# Altium schematic sheet MCU103A_AltRouting_Misc.SchDoc
size 431 x 279 mm; Date: Not shown in title block; ApprovedBy: Not shown in title block; CheckedBy: Not shown in title block; Author: Not shown in title block; CompanyName: Not shown in title block; Engineer: Not shown in title block; Organization: Not shown in title block; Address1: Not shown in title block; Address2: Not shown in title block; Address3: Not shown in title block; Address4: Not shown in title block; DocumentNumber: 3; Revision: Use project parameter SCH_Rev; SheetNumber: 3; SheetTotal: 8; PageSetup: Record=PageOptions|CenterHorizontal=True|CenterVertical=True|PrintScale=1.00|XCorrection=1.00|YCorrection=1.00|PrintKind=0|BorderSize=5000000|LeftOffset=0|BottomOffset=0|Orientation=2|PaperLength=1000|PaperWidth=1000|Scale=100|PaperSource=15|PrintQuality=600|MediaType=1|DitherType=10|PaperKind=Letter|PrintScaleMode=1; CurrentTime: Not shown in title block; CurrentDate: Not shown in title block; Time: Not shown in title block; DocumentFullPathAndName: Not shown in title block; DocumentName: Not shown in title block; ModifiedDate: Not shown in title block; ImagePath: Not shown in title block
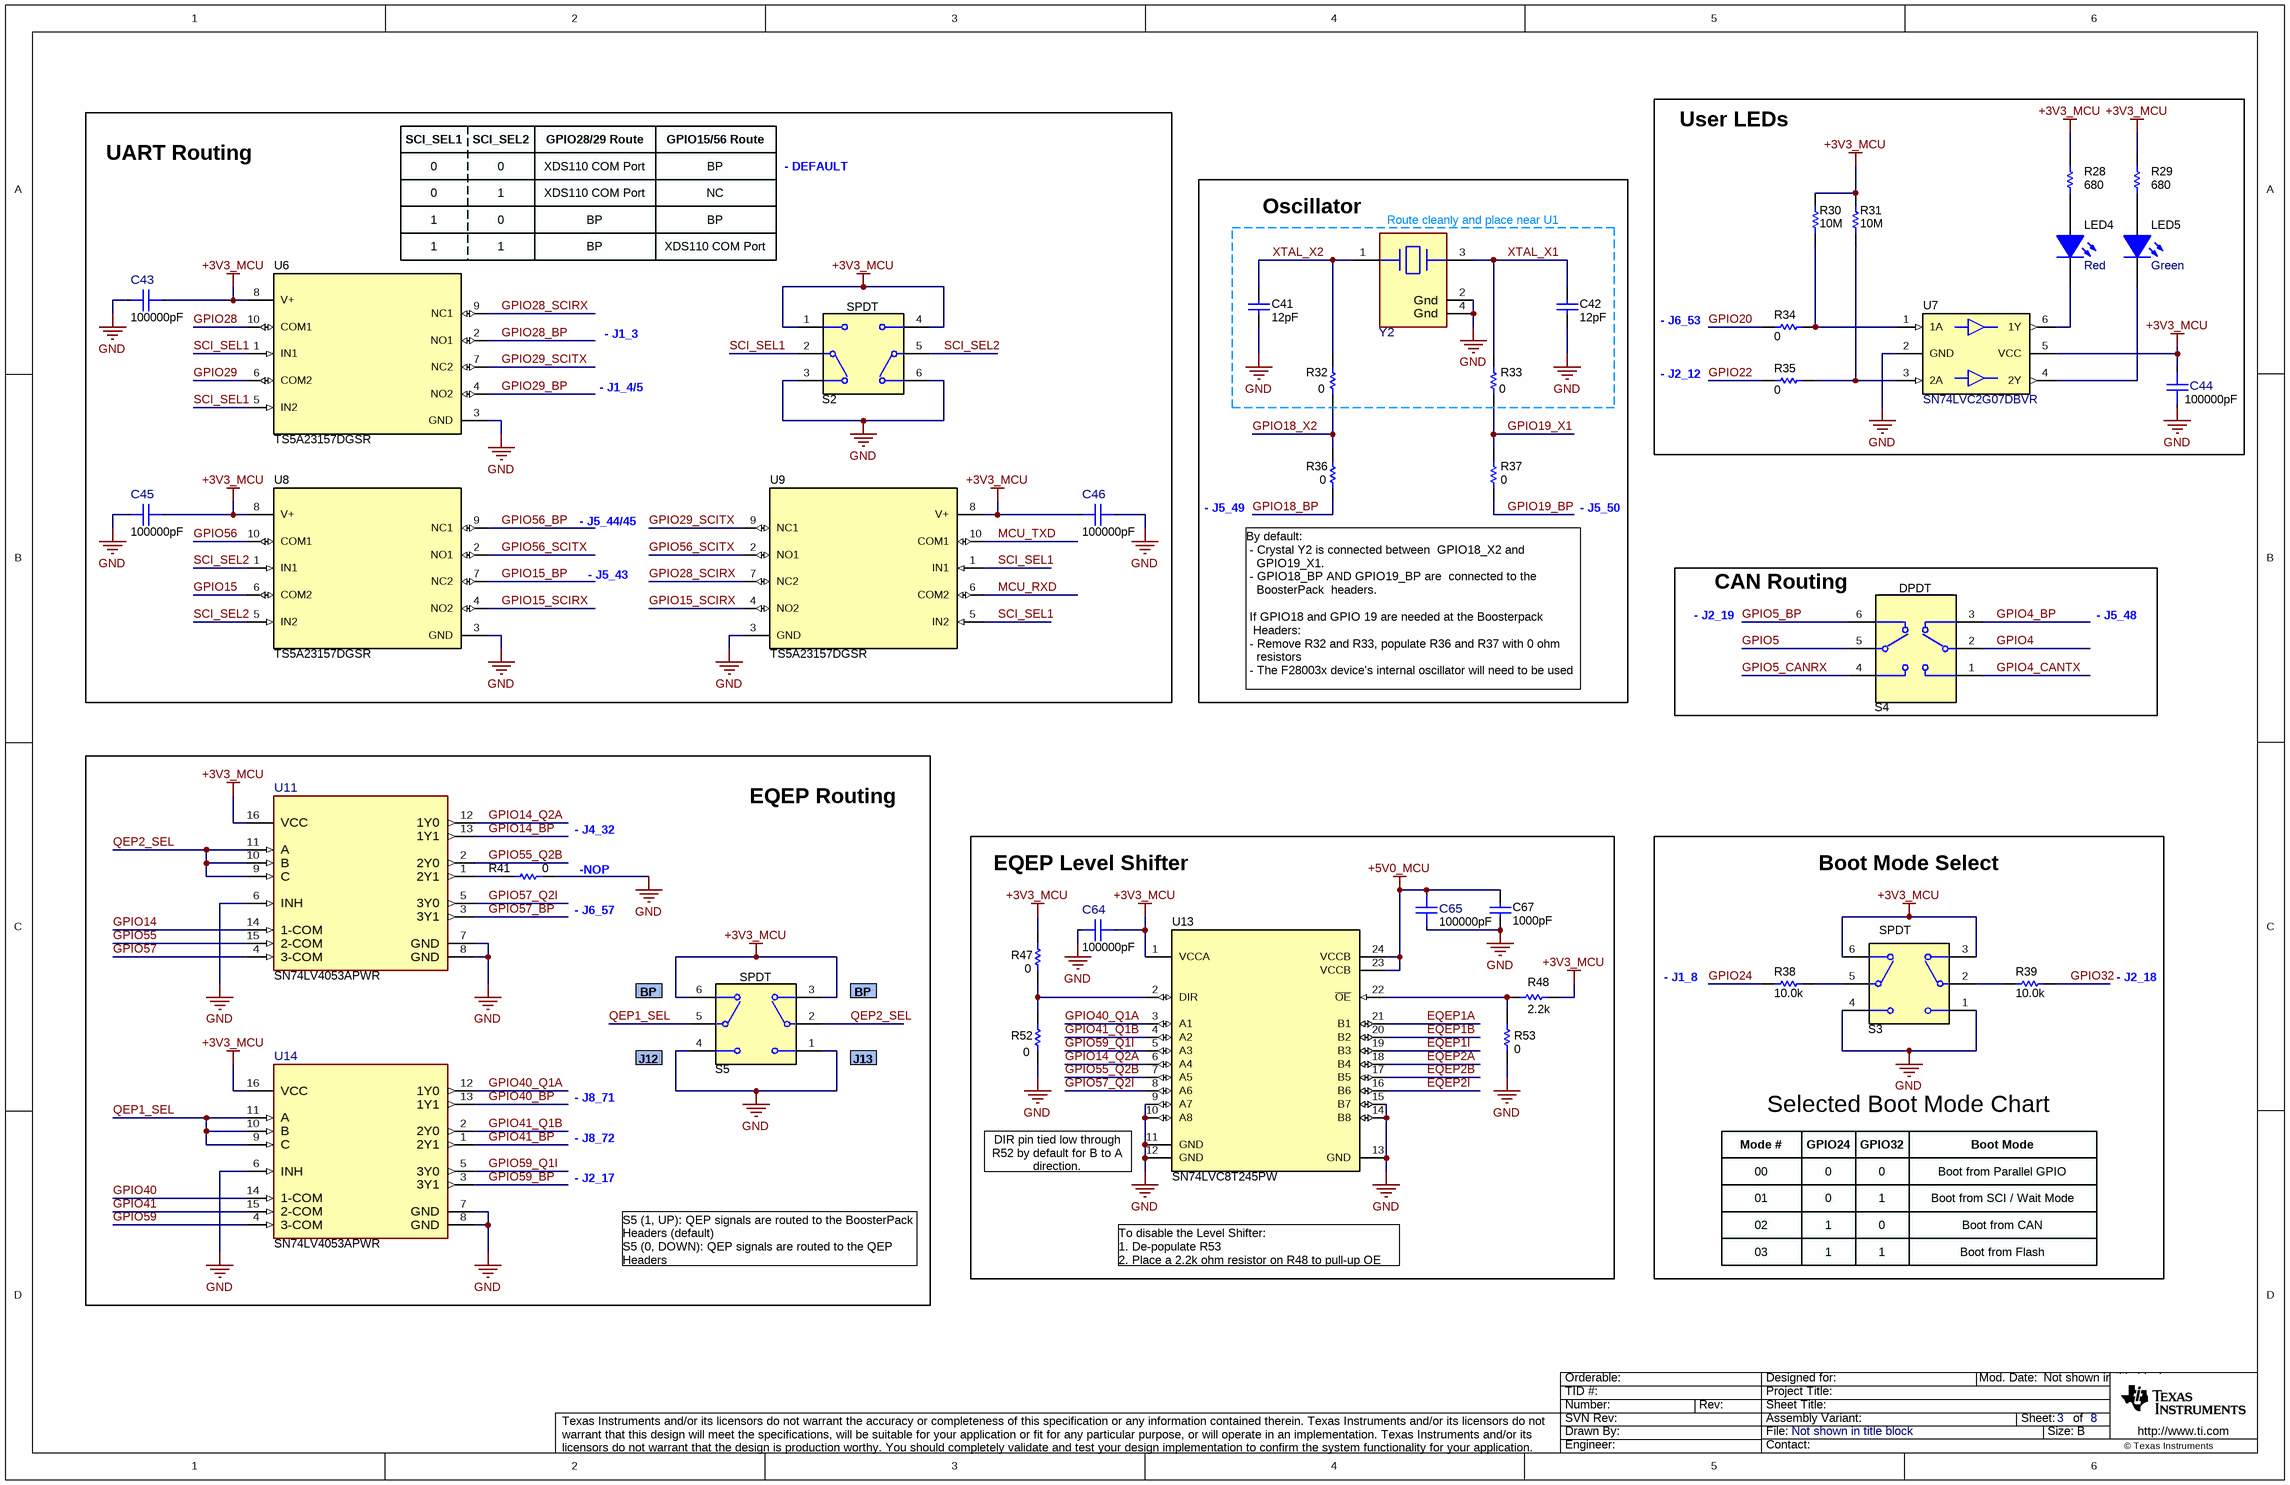
[diagram p0: MCU103A_AltRouting_Misc.SchDoc]

## Parts
C41  ValueDisplayed: 12pF  [0402]  (hidden comment: C0402C120J3GACAUTO)
C42  ValueDisplayed: 12pF  [0402]  (hidden comment: C0402C120J3GACAUTO)
C43  ValueDisplayed: 100000pF  [FP-885012205018_0402-MFG]  (hidden comment: 885012205018)
C44  ValueDisplayed: 100000pF  [FP-885012205018_0402-MFG]  (hidden comment: 885012205018)
C45  ValueDisplayed: 100000pF  [FP-885012205018_0402-MFG]  (hidden comment: 885012205018)
C46  ValueDisplayed: 100000pF  [FP-885012205018_0402-MFG]  (hidden comment: 885012205018)
C64  ValueDisplayed: 100000pF  [FP-885012205018_0402-MFG]  (hidden comment: 885012205018)
C65  ValueDisplayed: 100000pF  [FP-885012205018_0402-MFG]  (hidden comment: 885012205018)
C67  ValueDisplayed: 1000pF  [0402]  (hidden comment: 885012205061)
LED4  value Red  [WL-SMCW_RED_0805]  (hidden comment: 150080SS75000)
LED5  value Green  [LED_LTST-C171]  (hidden comment: LTST-C171GKT)
R28  ValueDisplayed: 680  [0402]  (hidden comment: CRCW0402680RJNED)
R29  ValueDisplayed: 680  [0402]  (hidden comment: CRCW0402680RJNED)
R30  ValueDisplayed: 10M  [0402]  (hidden comment: CRCW040210M0JNED)
R31  ValueDisplayed: 10M  [0402]  (hidden comment: CRCW040210M0JNED)
R32  ValueDisplayed: 0  [0603]  (hidden comment: CRCW06030000Z0EA)
R33  ValueDisplayed: 0  [0603]  (hidden comment: CRCW06030000Z0EA)
R34  ValueDisplayed: 0  [0603]  (hidden comment: CRCW06030000Z0EA)
R35  ValueDisplayed: 0  [0603]  (hidden comment: CRCW06030000Z0EA)
R36  ValueDisplayed: 0  [0603]  (hidden comment: CRCW06030000Z0EA)
R37  ValueDisplayed: 0  [0603]  (hidden comment: CRCW06030000Z0EA)
R38  ValueDisplayed: 10.0k  [0603]  (hidden comment: RC0603FR-0710KL)
R39  ValueDisplayed: 10.0k  [0603]  (hidden comment: RC0603FR-0710KL)
R41  ValueDisplayed: 0  [0603]  (hidden comment: CRCW06030000Z0EA)
R47  ValueDisplayed: 0  [0603]  (hidden comment: CRCW06030000Z0EA)
R48  ValueDisplayed: 2.2k  [0603]  (hidden comment: CRCW06032K20JNEA)
R52  ValueDisplayed: 0  [0603]  (hidden comment: CRCW06030000Z0EA)
R53  ValueDisplayed: 0  [0603]  (hidden comment: CRCW06030000Z0EA)
S2  CAS-D20TA  [SW_CAS-D20TA]  (value not drawn)
S3  CAS-D20TA  [SW_CAS-D20TA]  (value not drawn)
S4  CAS-220TA  [SW_CAS-220TA]  (value not drawn)
S5  CAS-D20TA  [SW_CAS-D20TA]  (value not drawn)
U6  TS5A23157DGSR  [DGS0010A_N]
U7  SN74LVC2G07DBVR  [DBV0006A_N]
U8  TS5A23157DGSR  [DGS0010A_N]
U9  TS5A23157DGSR  [DGS0010A_N]
U11  SN74LV4053APWR  [PW0016A-MFG]
U13  SN74LVC8T245PW  [PW0024A_N]
U14  SN74LV4053APWR  [PW0016A-MFG]
Y2  ECS-200-8-30B-CKM  [FP-ECS-200-8-30B-CKM_SMD4-MFG]  (value not drawn)

## Blocks framed on the sheet
UART Routing: C43 C45 C46 S2 U6 U8 U9
User LEDs: C44 LED4 LED5 R28-R31 R34 R35 U7
Oscillator: C41 C42 R32 R33 R36 R37 Y2
CAN Routing: S4
EQEP Routing: R41 S5 U11 U14
EQEP Level Shifter: C64 C65 C67 R47 R48 R52 R53 U13
Selected Boot Mode Chart: R38 R39 S3

## Nets
+3V3_MCU: C43.1 C44.2 C45.1 C46.2 C64.1 R28.2 R29.2 R30.2 R31.2 R47.2 R48.2 S2.1 S2.4 S3.3 S3.6 S5.3 S5.6 U6.8(V+) U7.5(VCC) U8.8(V+) U9.8(V+) U11.16(VCC) U13.1(VCCA) U14.16(VCC)
+5V0_MCU: C65.2 C67.1 U13.23(VCCB) U13.24(VCCB)
GND: C41.2 C42.2 C43.2 C44.1 C45.2 C46.1 C64.2 C65.1 C67.2 R41.2 R52.1 R53.2 S2.3 S2.6 S3.1 S3.4 S5.1 S5.4 U6.3(GND) U7.2(GND) U8.3(GND) U9.3(GND) U11.6(INH) U11.7(GND) U11.8(GND) U13.9(A7) U13.10(A8) U13.11(GND) U13.12(GND) U13.13(GND) U13.14(B8) U13.15(B7) U14.6(INH) U14.7(GND) U14.8(GND) Y2.2(Gnd) Y2.4(Gnd)
EQEP1A: U13.21(B1)
EQEP1B: U13.20(B2)
EQEP1I: U13.19(B3)
EQEP2A: U13.18(B4)
EQEP2B: U13.17(B5)
EQEP2I: U13.16(B6)
GPIO4: S4.2
GPIO4_BP: S4.3
GPIO4_CANTX: S4.1
GPIO5: S4.5
GPIO5_BP: S4.6
GPIO5_CANRX: S4.4
GPIO14: U11.14(1-COM)
GPIO14_BP: U11.13(1Y1)
GPIO14_Q2A: U11.12(1Y0) U13.6(A4)
GPIO15: U8.6(COM2)
GPIO15_BP: U8.7(NC2)
GPIO15_SCIRX: U8.4(NO2) U9.4(NO2)
GPIO18_BP: R36.1
GPIO18_X2: R32.1 R36.2
GPIO19_BP: R37.1
GPIO19_X1: R33.1 R37.2
GPIO20: R34.1
GPIO22: R35.1
GPIO24: R38.1
GPIO28: U6.10(COM1)
GPIO28_BP: U6.2(NO1)
GPIO28_SCIRX: U6.9(NC1) U9.7(NC2)
GPIO29: U6.6(COM2)
GPIO29_BP: U6.4(NO2)
GPIO29_SCITX: U6.7(NC2) U9.9(NC1)
GPIO32: R39.2
GPIO40: U14.14(1-COM)
GPIO40_BP: U14.13(1Y1)
GPIO40_Q1A: U13.3(A1) U14.12(1Y0)
GPIO41: U14.15(2-COM)
GPIO41_BP: U14.1(2Y1)
GPIO41_Q1B: U13.4(A2) U14.2(2Y0)
GPIO55: U11.15(2-COM)
GPIO55_Q2B: U11.2(2Y0) U13.7(A5)
GPIO56: U8.10(COM1)
GPIO56_BP: U8.9(NC1)
GPIO56_SCITX: U8.2(NO1) U9.2(NO1)
GPIO57: U11.4(3-COM)
GPIO57_BP: U11.3(3Y1)
GPIO57_Q2I: U11.5(3Y0) U13.8(A6)
GPIO59: U14.4(3-COM)
GPIO59_BP: U14.3(3Y1)
GPIO59_Q1I: U13.5(A3) U14.5(3Y0)
MCU_RXD: U9.6(COM2)
MCU_TXD: U9.10(COM1)
QEP1_SEL: S5.5(C) U14.9(C) U14.10(B) U14.11(A)
QEP2_SEL: S5.2(C) U11.9(C) U11.10(B) U11.11(A)
SCI_SEL1: S2.2(C) U6.1(IN1) U6.5(IN2) U9.1(IN1) U9.5(IN2)
SCI_SEL2: S2.5(C) U8.1(IN1) U8.5(IN2)
XTAL_X1: C42.1 R33.2 Y2.3(Out/In)
XTAL_X2: C41.1 R32.2 Y2.1(In/Out)
NetLED4_1: LED4.1(K) U7.6(1Y)
NetLED4_2: LED4.2(A) R28.1
NetLED5_1: LED5.1(A) R29.1
NetLED5_2: LED5.2(K) U7.4(2Y)
NetR30_1: R30.1 R34.2 U7.1(1A)
NetR31_1: R31.1 R35.2 U7.3(2A)
NetR38_2: R38.2 S3.5(C)
NetR39_1: R39.1 S3.2(C)
NetR41_1: R41.1 U11.1(2Y1)
NetR47_1: R47.1 R52.2 U13.2(DIR)
NetR48_1: R48.1 R53.1 U13.22(~{OE})

## Notes on the sheet
- SCI_SEL1
- 0
- SCI_SEL2
- GPIO28/29 Route
- XDS110 COM Port
- GPIO15/56 Route
- BP
- - DEFAULT
- 1
- NC
- (near Y2) Route cleanly and place near U1
- (near U6) 1
- (near S2) SPDT
- - J1_3
- - J6_53
- - J1_4/5
- - J2_12
- - J5_44/45
- - J5_43
- - J5_49
- - J5_50
- - J2_19
- (near S4) DPDT
- - J5_48
- By default:
  - Crystal Y2 is connected between  GPIO18_X2 and
  GPIO19_X1.
  - GPIO18_BP AND GPIO19_BP are  connected to the
  BoosterPack  headers.
  If GPIO18 and GPIO 19 are needed at the Boosterpack
  Headers:
  - Remove R32 and R33, populate R36 and R37 with 0 ohm
  resistors
  - The F28003x device's internal oscillator will need to be used
- (near R41) - J4_32
- (near R41) -NOP
- Boot Mode Select
- (near R41) - J6_57
- (near S5) SPDT
- - J1_8
- (near S3) SPDT
- - J2_18
- - J8_71
- J12
- J13
- - J8_72
- (near U13) DIR pin tied low through R52 by default for B to A direction.
- Mode #
- 00
- GPIO24
- GPIO32
- Boot Mode
- Boot from Parallel GPIO
- - J2_17
- 01
- 02
- Boot from SCI / Wait Mode
- Boot from CAN
- S5 (1, UP): QEP signals are routed to the BoosterPack Headers (default)
  S5 (0, DOWN): QEP signals are routed to the QEP Headers
- To disable the Level Shifter:
  1. De-populate R53
  2. Place a 2.2k ohm resistor on R48 to pull-up OE
- 03
- Boot from Flash
- Drawn By:
- SVN Rev:
- Number:
- TID #:
- Orderable:
- Rev:
- Sheet Title:
- File:
- Project Title:
- Designed for:
- Assembly Variant:
- Mod. Date:
- Sheet:
- Size:
- of
- B
- http://www.ti.com
- Texas Instruments and/or its licensors do not warrant the accuracy or completeness of this specification or any information contained therein. Texas Instruments and/or its licensors do not warrant that this design will meet the specifications, will be suitable for your application or fit for any particular purpose, or will operate in an implementation. Texas Instruments and/or its licensors do not warrant that the design is production worthy. You should completely validate and test your design implementation to confirm the system functionality for your application.
- Engineer:
- Contact:
- © Texas Instruments

## Library data of the parts
C41 C42 = CMP-0006239-2: CAP, CERM, 12 pF, 25 V, +/- 5%, C0G/NP0, AEC-Q200 Grade 1, 0402; Manufacturer: Kemet; TaMin_C: -55°C; Polarized: N; SizeAreaWB_mm2: 3; Value1: Unknown; U/M: EA; Value: 12pF; TaMax_C: 125°C; SizeZ_mm: 0.6; SizeX_mm: 1; SizeY_mm: 0.5; Value2: 25V; AEC Qualified: Y; AEC Category: Q200; Supplier Part Number 2: 86T2558; Publisher: Texas Instruments; Supplier 2: Newark; Supplier Part Number 3: 80-C0402C120J3GAUTO; TempCo: C0G/NP0; Supplier 3: Mouser; Published: 2008-06-19; RoHS: Y; MountType: SMT; Supplier 1: Digi-Key; PackageReference: 0402; Tolerance_%: 5%; Cap_Case: 0402; SizeArea_mm2: 0.5; CompType: Capacitor; LatestRevisionDate: 2017-03-09; PartNumber: C0402C120J3GACAUTO; Cap_F: 12pF; VDC_V: 25V; ComponentLink1Description: Datasheet link; AEC Grade: 1; Supplier Part Number 1: 399-6829-1-ND; Technology: Ceramic; ComponentLink1URL: http://www.kemet.com/Lists/ProductCatalog/Attachments/420/KEM_C1022_C0G_AUTO_SMD.pdf
C43-C46 C64 C65 = CMP-0090362-1: 0.1µF ±10% 10V Ceramic Capacitor X7R 0402 (1005 Metric); Manufacturer: Wurth Electronics; AEC Qualified: No; Value: 100nF; SizeZ_mm: 0.55mm; TempCo: 15%; RoHS: TRUE; Tolerance_%: 10%; datasheet: https://www.we-online.com/catalog/datasheet/885012205018.pdf; Lead Free: Yes; Operating Temperature Range: -55°C to +125°C; ComponentLink1Description: Datasheet; Digikey Description: CAP CER 0.1UF 10V X7R 0402; Supplier Part Number 1: 732-7513-1-ND; Supplier 2: Mouser; Mouser Part Number: 710-885012205018; Digikey Part Number: 732-7513-1-ND; Temperature Characteristic: X7R; Supplier 1: Digikey; Datasheet Path: datasheets/Cap-885012205018.pdf; ComponentLink1URL: https://www.we-online.com/catalog/datasheet/885012205018.pdf; VDC_V: 10V; Supplier Part Number 2: 710-885012205018; Cap_F: 100nF; PackageReference: 0402; PartNumber: 885012205018; Part Number: 885012205018; helpURL: https://upverter.com/upn/revision/1acbe355db19639d/
C67 = CMP-0006231-2: CAP, CERM, 1000 pF, 50 V, +/- 10%, X7R, 0402; Manufacturer: Wurth Elektronik; Polarized: N; Value: 1000pF; U/M: EA; Cap_F: 1nF; Value1: Unknown; VDC_V: 50V; TaMin_C: -55°C; TaMax_C: 125°C; SizeArea_mm2: 0.5; SizeAreaWB_mm2: 3; SizeX_mm: 1; SizeZ_mm: 0.6; AEC Category: Q200; CompType: Capacitor; PartNumber: 885012205061; PackageReference: 0402; RoHS: Y; Tolerance_%: 10%; Value2: 50V; MountType: SMT; Technology: Ceramic; TempCo: X7R; Cap_Case: 0402; SizeY_mm: 0.5; Published: 2008-06-19; Publisher: Texas Instruments; LatestRevisionDate: 2017-03-09; ComponentLink1Description: Datasheet link; ComponentLink1URL: http://katalog.we-online.de/pbs/datasheet/885012205061.pdf; Supplier 1: Digi-Key; Supplier Part Number 1: 732-7556-1-ND; Supplier 2: Mouser; Supplier Part Number 2: 710-885012205061; AEC Qualified: N; AEC Grade: N/A
LED4 = CMP-0002951-3: LED, Red, SMD; Manufacturer: Wurth Elektronik; Type: AlInGaP; Vf_V: 1.9V; Io_A: 30mA; Vr_V: 5V; Ir_A: 25µA; Tjmax_C: 85°C; Power_TotalModule: 72mW; Value1: 0.072W; Angle: 140; CompType: LED; PartNumber: 150080SS75000; MountType: SMT; RoHS: Y; PackageReference: LED_0805; Value2: 1.9V; Color: Red; ComponentLink1URL: http://katalog.we-online.de/led/datasheet/150080SS75000.pdf; ComponentLink1Description: Datasheet link
LED5 = CMP-0002830-3: LED, Green, SMD; Manufacturer: Lite-On; Type: AlInGaP; Vf_V: 2.1V; Io_A: 20A; Value1: W; SizeAreaWB_mm2: 6.75; SizeArea_mm2: 2.5; SizeX_mm: 2; SizeY_mm: 1.25; SizeZ_mm: 1.2; CompType: LED; PartNumber: LTST-C171GKT; MountType: SMT; RoHS: Y; PackageReference: 0805 LED; Value2: 2.1V; Color: green; ComponentLink1URL: https://sps06.itg.ti.com/sites/KMS/crossdivteams/altium/docs/ComponentDatasheets/LTST-C171GKT.pdf; ComponentLink1Description: Datasheet link
R28 R29 = CMP-0026962-3: RES, 680, 5%, 0.063 W, AEC-Q200 Grade 0, 0402; Manufacturer: Vishay-Dale; Power_W: 63mW; TempCo: 200 ppm/C; Value_Code: 680R; Value: 680; EIA_Code: E24; SizeX_mm: 1; SizeY_mm: 0.5; SizeZ_mm: 0.6; Value2: 0.063W; AEC Qualified: Y; VDC_V: 50V; AEC Category: Q200; AEC Grade: 0; Supplier Part Number 2: 59M6744; Supplier 2: Newark; Supplier Part Number 3: 71-CRCW0402J-680-E3; Supplier 3: Mouser; RoHS: E; Value1: 5%; MountType: SMT; Supplier 1: Digi-Key; PackageReference: 0402; Tolerance_%: 5%; Res_ohm: 680; SizeArea_mm2: 0.5; CompType: Resistor; PartNumber: CRCW0402680RJNED; ComponentLink1Description: Datasheet link; Supplier Part Number 1: 541-680JCT-ND; Technology: Thick Film; ComponentLink1URL: http://www.vishay.com/docs/20035/dcrcwe3.pdf
R30 R31 = CMP-0026826-2: RES, 10 M, 5%, 0.063 W, AEC-Q200 Grade 0, 0402; Manufacturer: Vishay-Dale; Value: 10Meg; Value_Code: 10M0; Power_W: 63mW; Value2: 0.063W; VDC_V: 50V; TempCo: 200 ppm/C; SizeArea_mm2: 0.5; SizeX_mm: 1; SizeZ_mm: 0.6; EIA_Code: E24; AEC Category: Q200; AEC Qualified: Y; AEC Grade: 0; CompType: Resistor; PartNumber: CRCW040210M0JNED; PackageReference: 0402; RoHS: E; Res_ohm: 10M; Tolerance_%: 5%; Value1: 5%; MountType: SMT; Technology: Thick Film; SizeY_mm: 0.5; ComponentLink1Description: Datasheet link; ComponentLink1URL: http://www.vishay.com/docs/20035/dcrcwe3.pdf; Supplier 1: Digi-Key; Supplier Part Number 1: 541-10MJCT-ND; Supplier 2: Newark; Supplier Part Number 2: 59M6697; Supplier 3: Mouser; Supplier Part Number 3: 71-CRCW0402J-10M-E3
R32-R37 R41 R47 R52 R53 = CMP-0025697-4: RES, 0, 5%, 0.1 W, AEC-Q200 Grade 0, 0603; Manufacturer: Vishay-Dale; Value: 0; Value_Code: 0000; Power_W: 100mW; Value2: 0.1W; VDC_V: 75V; TempCo: 200 ppm/C; SizeArea_mm2: 1.28; SizeX_mm: 1.6; SizeY_mm: 0.8; SizeZ_mm: 1; EIA_Code: E24; AEC Category: Q200; AEC Qualified: Y; CompType: Resistor; PartNumber: CRCW06030000Z0EA; PackageReference: 0603; RoHS: E; Res_ohm: 0; Tolerance_%: 5%; Value1: 5%; MountType: SMT; Technology: Thick Film; ComponentLink1Description: Datasheet link; ComponentLink1URL: http://www.vishay.com/docs/20035/dcrcwe3.pdf; Supplier 1: Digi-Key; Supplier Part Number 1: 541-0.0GCT-ND; Supplier 2: Newark; Supplier Part Number 2: 52K8014; Supplier 3: Mouser; Supplier Part Number 3: 71-CRCW0603-0-E3; AEC Grade: 0
R38 R39 = CMP-0022746-5: RES, 10.0 k, 1%, 0.1 W, 0603; Manufacturer: Yageo; Power_W: 100mW; TempCo: 100 ppm/C; Value_Code: 10k0; Value: 10.0k; EIA_Code: E96; Res_ohm: 10k; SizeX_mm: 1.6; SizeY_mm: 0.8; SizeZ_mm: 1; Value2: 0.1W; SizeArea_mm2: 1.28; AEC Qualified: N; VDC_V: 75V; AEC Category: Q200; SizeAreaWB_mm2: 4.68; Supplier Part Number 2: 603-RC0603FR-0710KL; Supplier 2: Mouser; Supplier Part Number 3: 9238603; Supplier 3: Farnell; RoHS: Y; Value1: 1%; MountType: SMT; Supplier 1: Digi-Key; PackageReference: 0603; Tolerance_%: 1%; CompType: Resistor; PartNumber: RC0603FR-0710KL; ComponentLink1Description: Datasheet link; Supplier Part Number 1: 311-10.0KHRCT-ND; Technology: Thick Film; ComponentLink1URL: http://www.yageo.com/pdf/Pu-RC0603_51_PbFree_L_2.pdf; AEC Grade: N/A
R48 = CMP-0025769-4: RES, 2.2 k, 5%, 0.1 W, AEC-Q200 Grade 0, 0603; Manufacturer: Vishay-Dale; Value: 2.2k; Value_Code: 2k20; Power_W: 100mW; Value2: 0.1W; VDC_V: 75V; TempCo: 200 ppm/C; SizeArea_mm2: 1.28; SizeX_mm: 1.6; SizeY_mm: 0.8; SizeZ_mm: 1; EIA_Code: E24; AEC Category: Q200; AEC Qualified: Y; AEC Grade: 0; CompType: Resistor; PartNumber: CRCW06032K20JNEA; PackageReference: 0603; RoHS: E; Res_ohm: 2.2k; Tolerance_%: 5%; Value1: 5%; MountType: SMT; Technology: Thick Film; ComponentLink1Description: Datasheet link; ComponentLink1URL: http://www.vishay.com/docs/20035/dcrcwe3.pdf; Supplier 1: Digi-Key; Supplier Part Number 1: 541-2.2KGCT-ND; Supplier 2: Newark; Supplier Part Number 2: 59M6776; Supplier 3: Farnell; Supplier Part Number 3: 1652868
S2 S5 = CMP-0002233-1: Switch, Dual SPDT,  2 Pos, 0.1A, 6VDC, SMD; Manufacturer: Copal Electronics; VDC_V: 6V; SwitchFunction: On-On; PositionCount: 2; CurrentRating_mA: 100A; PartNumber: CAS-D20TA; MountType: SMT; ComponentLink1Description: Datasheet Link; ComponentLink1URL: http://www.nidec-copal-electronics.com/e/catalog/switch/cas.pdf; RoHS: Y; Circuit: SPDT; Orientation: Top Actuated; CompType: Switch; PackageReference: 5.4x3.9mm; Publisher: Texas Instruments; LatestRevisionDate: 2017-03-09; Supplier 1: Digi-Key; Supplier Part Number 1: CASD20JCT-ND
S3 = CMP-0002233-1: Switch, Dual SPDT,  2 Pos, 0.1A, 6VDC, SMD; Manufacturer: Copal Electronics; CurrentRating_mA: 100A; SwitchFunction: On-On; VDC_V: 6V; PositionCount: 2; ComponentLink1Description: Datasheet Link; LatestRevisionDate: 2017-03-09; PackageReference: 5.4x3.9mm; Publisher: Texas Instruments; Supplier 1: Digi-Key; ComponentLink1URL: http://www.nidec-copal-electronics.com/e/catalog/switch/cas.pdf; Supplier Part Number 1: CASD20JCT-ND; MountType: SMT; Circuit: SPDT; Orientation: Top Actuated; PartNumber: CAS-D20TA; CompType: Switch; RoHS: Y
S4 = CMP-0002123-2: SLIDE SWITCH DPDT  .1A, SMT; Manufacturer: Copal Electronics; VDC_V: 6V; SwitchFunction: On-On; PositionCount: 2; CurrentRating_mA: 100A; PartNumber: CAS-220TA; MountType: SMT; ComponentLink1Description: Datasheet URL; ComponentLink1URL: http://copal-electronics.info/en/0008e/02462.pdf; RoHS: Y; Circuit: DPDT; Orientation: Horizontal; CompType: Switch; PackageReference: SWITCH, 5.4x2.5x3.9mm; Publisher: Texas Instruments; LatestRevisionDate: 2017-03-09; Supplier 1: Digi-Key; Supplier Part Number 1: CAS220JCT-ND
U6 U8 U9 = CMP-0067418-1: DUAL 10-Ohm SPDT ANALOG SWITCH, DGS0010A (VSSOP-10); Alternate PartNumber: TS5A23157DGST; Alternate Manufacturer: Texas Instruments; Green_Lifecycle: Active; SizeAreaWB_mm2: 23.6; Green_REACh: Passed; U/M: EA; SizeZ_mm: 1.1; SizeX_mm: 4.9; SizeY_mm: 3.0; SizeArea_mm2: 14.7; CompType: IC; ComponentLink1URL: http://www.ti.com/lit/ds/symlink/ts5a23157.pdf; Publisher: Texas Instruments; PackageDescription: VSSOP-10; RoHS: Y; Footprint Path 6: C:\AltiumLibraries\Footprints\TI\.PcbLib; MountType: SMT; Green_EU RoHS-2: Passed; Manufacturer: Texas Instruments; Green_EU RoHS: Passed; PackageReference: DGS0010A; LatestRevisionDate: 2017-06-09; PartNumber: TS5A23157DGSR; ComponentLink1Description: Datasheet Link
U7 = CMP-0051789-2: Dual Buffer/Driver with Open-Drain Output, DBV0006A, LARGE T&R; Manufacturer: Texas Instruments; VCC(Min)(V): 1.65; VCC(Max)(V): 5.5; Output Type: CMOS; ICC @ Nom Voltage(Max)(mA): 0.01; Input Type: CMOS/TTL; Bits(#): 2; F @ Nom Voltage(Max)(Mhz): 150; Rating: Catalog; Technology Family: LVC; Voltage(Nom)(V): 1.8,2.5,3.3,5; Schmitt Trigger: No; Output Drive (IOL/IOH)(Max)(mA): 32/-32; tpd @ Nom Voltage(Max)(ns): 8.6,4.4,3.7,2.9; Logic: True; Sub-Family: Inverting Buffer/Driver; AEC Category: Q200; AEC Qualified: N; CompType: IC; Green_Lifecycle: Active; Green_REACh: Passed; SizeArea_mm2: 8.12; SizeAreaWB_mm2: 14.82; SizeX_mm: 2.8; SizeY_mm: 2.9; SizeZ_mm: 1.45; DatasheetVersion: SCES308K; PackageReference: DBV0006A; Generic Part Number: SN74LVC2G07; Operating Temperature Range(C): -40 to 125; 3-State Output: No; ComponentLink1Description: Datasheet Link; ComponentLink1URL: http://www.ti.com/lit/ds/symlink/sn74lvc2g07.pdf; ComponentLink2Description: Product Folder; ComponentLink2URL: http://www.ti.com/product/sn74lvc2g07; ComponentLink3Description: Online Datasheet; ComponentLink3URL: http://www.ti.com/product/sn74lvc2g07/datasheet; Green_EU RoHS-2: Passed; Green_EU RoHS: Passed; MountType: SMT; PackageDescription: SOT-23-6; PartNumber: SN74LVC2G07DBVR; RoHS: Y
U11 U14 = CMP-0089841-1: 3 Circuit IC Switch 2:1 75Ohm 16-TSSOP; Manufacturer: Texas Instruments; TaMax_C: +85°C; Max Supply Voltage: 5.5V; PositionCount: 3; AEC Qualified: No; SizeZ_mm: 1.2mm; Standoff Height: 0.05mm; On State Resistance: 100-225Ω; Min Supply Voltage: 2V; -3Db Bandwith: 50MHz; Nominal Supply Current: 20uA; TaMin_C: -40°C; Lead Free: Yes; Operating Temperature Range: -40°C to +85°C; Mux Demux Ratio: 2:1; ComponentLink1Description: Datasheet; Part Number: SN74LV4053APWR; Digikey Description: IC MUX/DEMUX TRIPLE 2X1 16TSSOP; ComponentLink1URL: https://upverter.com/datasheet/3a9d815208c4051a64f1f6fd539a8c5a24990e71.pdf; PartNumber: SN74LV4053APWR; Mouser Description: Multiplexer Switch ICs Triple 2-Ch Analog; Mouser Part Number: 595-SN74LV4053APWR; RoHS: TRUE; PackageReference: TSSOP16; helpURL: https://upverter.com/upn/revision/43c5e7c12a31b2aa/; datasheet: https://upverter.com/datasheet/3a9d815208c4051a64f1f6fd539a8c5a24990e71.pdf; Digikey Part Number: 296-3833-1-ND; Datasheet Path: datasheets/IC-SN74LV4053APWR.pdf
U13 = CMP-0066458-2: 8-Bit Dual-Supply Bus Transceiver with Configurable Voltage-Level Shifting and Three-State Outputs, PW0024A (TSSOP-24); Alternate Manufacturer: Texas Instruments; SizeAreaWB_mm2: 82.32; SizeZ_mm: 1.2; SizeX_mm: 6.4; SizeY_mm: 7.8; SizeArea_mm2: 49.92; CompType: IC; AEC Category: Q200; AEC Qualified: N; Rating: Catalog; ComponentLink1URL: http://www.ti.com/lit/ds/symlink/sn74lvc8t245.pdf; PackageDescription: TSSOP-24; RoHS: Y; MountType: SMT; Manufacturer: Texas Instruments; PackageReference: PW0024A; PartNumber: SN74LVC8T245PW; ComponentLink1Description: Datasheet Link; ComponentLink2Description: Product Folder; ComponentLink2URL: http://www.ti.com/product/sn74lvc8t245; ComponentLink3Description: Online Datasheet; ComponentLink3URL: http://www.ti.com/product/sn74lvc8t245/datasheet; Operating Temperature Range: -40 to 85 C
Y2 = CMP-0093370-1: 20 MHz ±10ppm Crystal 8pF 40 Ohms 4-SMD, No Lead; Manufacturer: ECS International; Frequency_Fixed: 20MHz; Esr: 40; SizeZ_mm: 0.85mm; Datasheet Path: datasheets/Crys-ECS-200-8-30B-CKM.pdf; ComponentLink1URL: https://ecsxtal.com/store/pdf/ecx_53b.pdf; Supplier Part Number 1: XC1841CT-ND; Operating Temperature Range: -20°C to +70°C; Tolerance_%: 10ppm; PartNumber: ECS-200-8-30B-CKM; PackageReference: SMD4; Mouser Part Number: 520-200-8-30B-CKM; ComponentLink1Description: Datasheet; Part Number: ECS-200-8-30B-CKM; Digikey Description: CRYSTAL 20.0000MHZ 8PF SMD; AEC Qualified: No; Load Capacitance: 8pF; Supplier 2: Mouser; Mouser Description: Crystals 20.000MHZ 8pF 10ppm -20C +70C; Supplier 1: Digikey; Frequency Stability: 10ppm; datasheet: https://ecsxtal.com/store/pdf/ecx_53b.pdf; Frequency Tolerance: 10ppm; Digikey Part Number: XC1841CT-ND; Lead Free: Yes; helpURL: https://upverter.com/upn/revision/b9ae4a09c701963d/; RoHS: TRUE; Series: ECX-53B; Supplier Part Number 2: 520-200-8-30B-CKM